# Altium schematic sheet MODULE.SchDoc: Air724UG 参考设计
size 594 x 419 mm; DESIGNER: Loukanghua; REV: V1.0
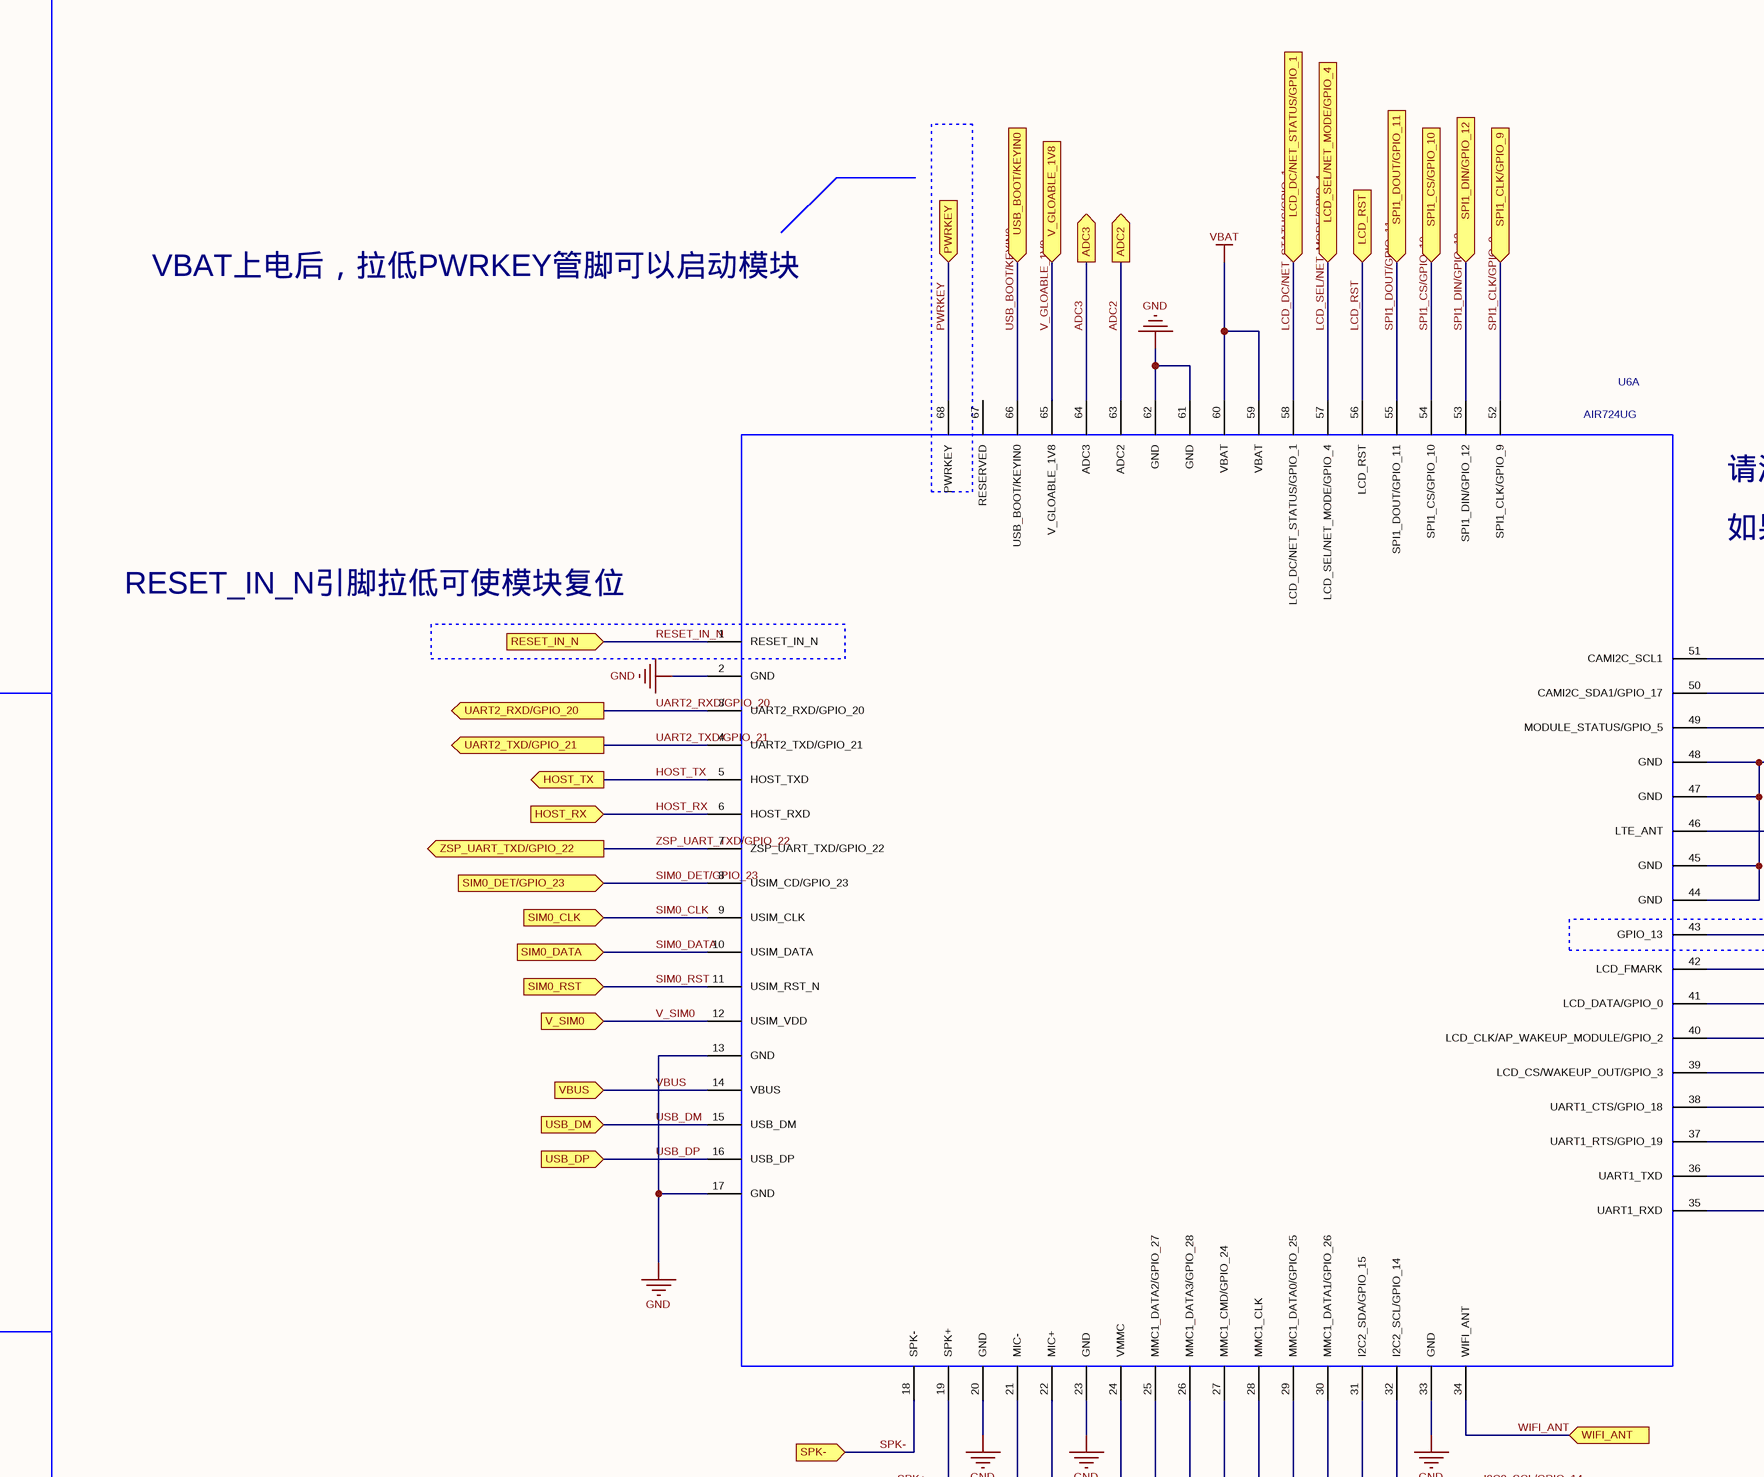
[diagram p0: MODULE.SchDoc, top left]
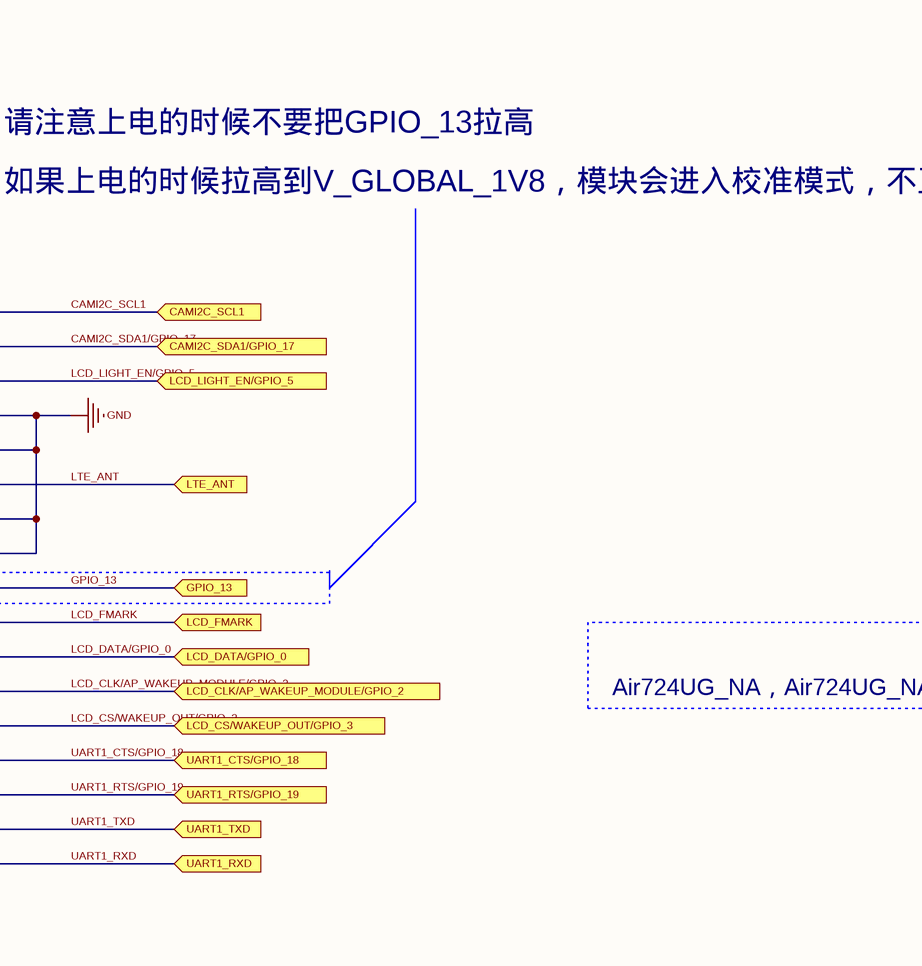
[diagram p1: MODULE.SchDoc, top middle]
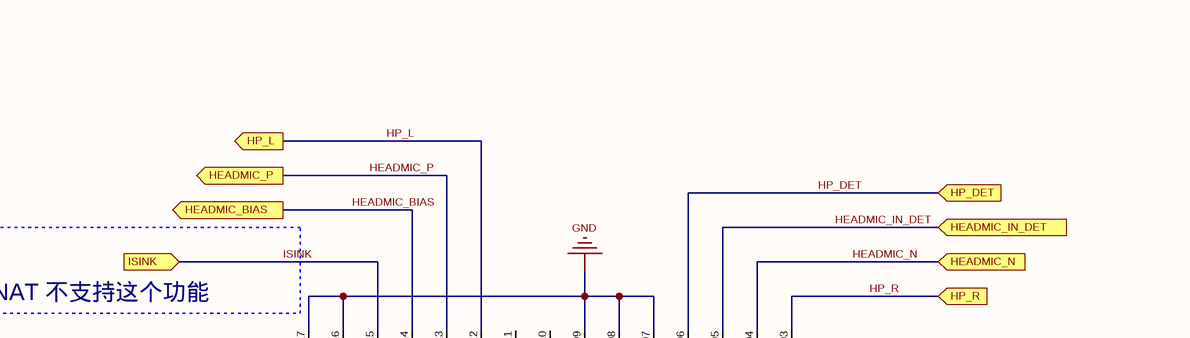
[diagram p2: MODULE.SchDoc, top right]
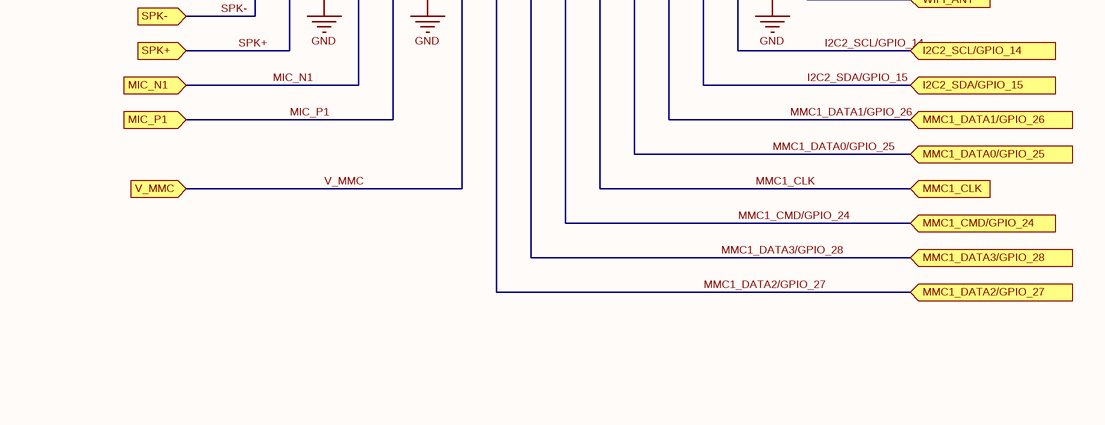
[diagram p3: MODULE.SchDoc, bottom left]
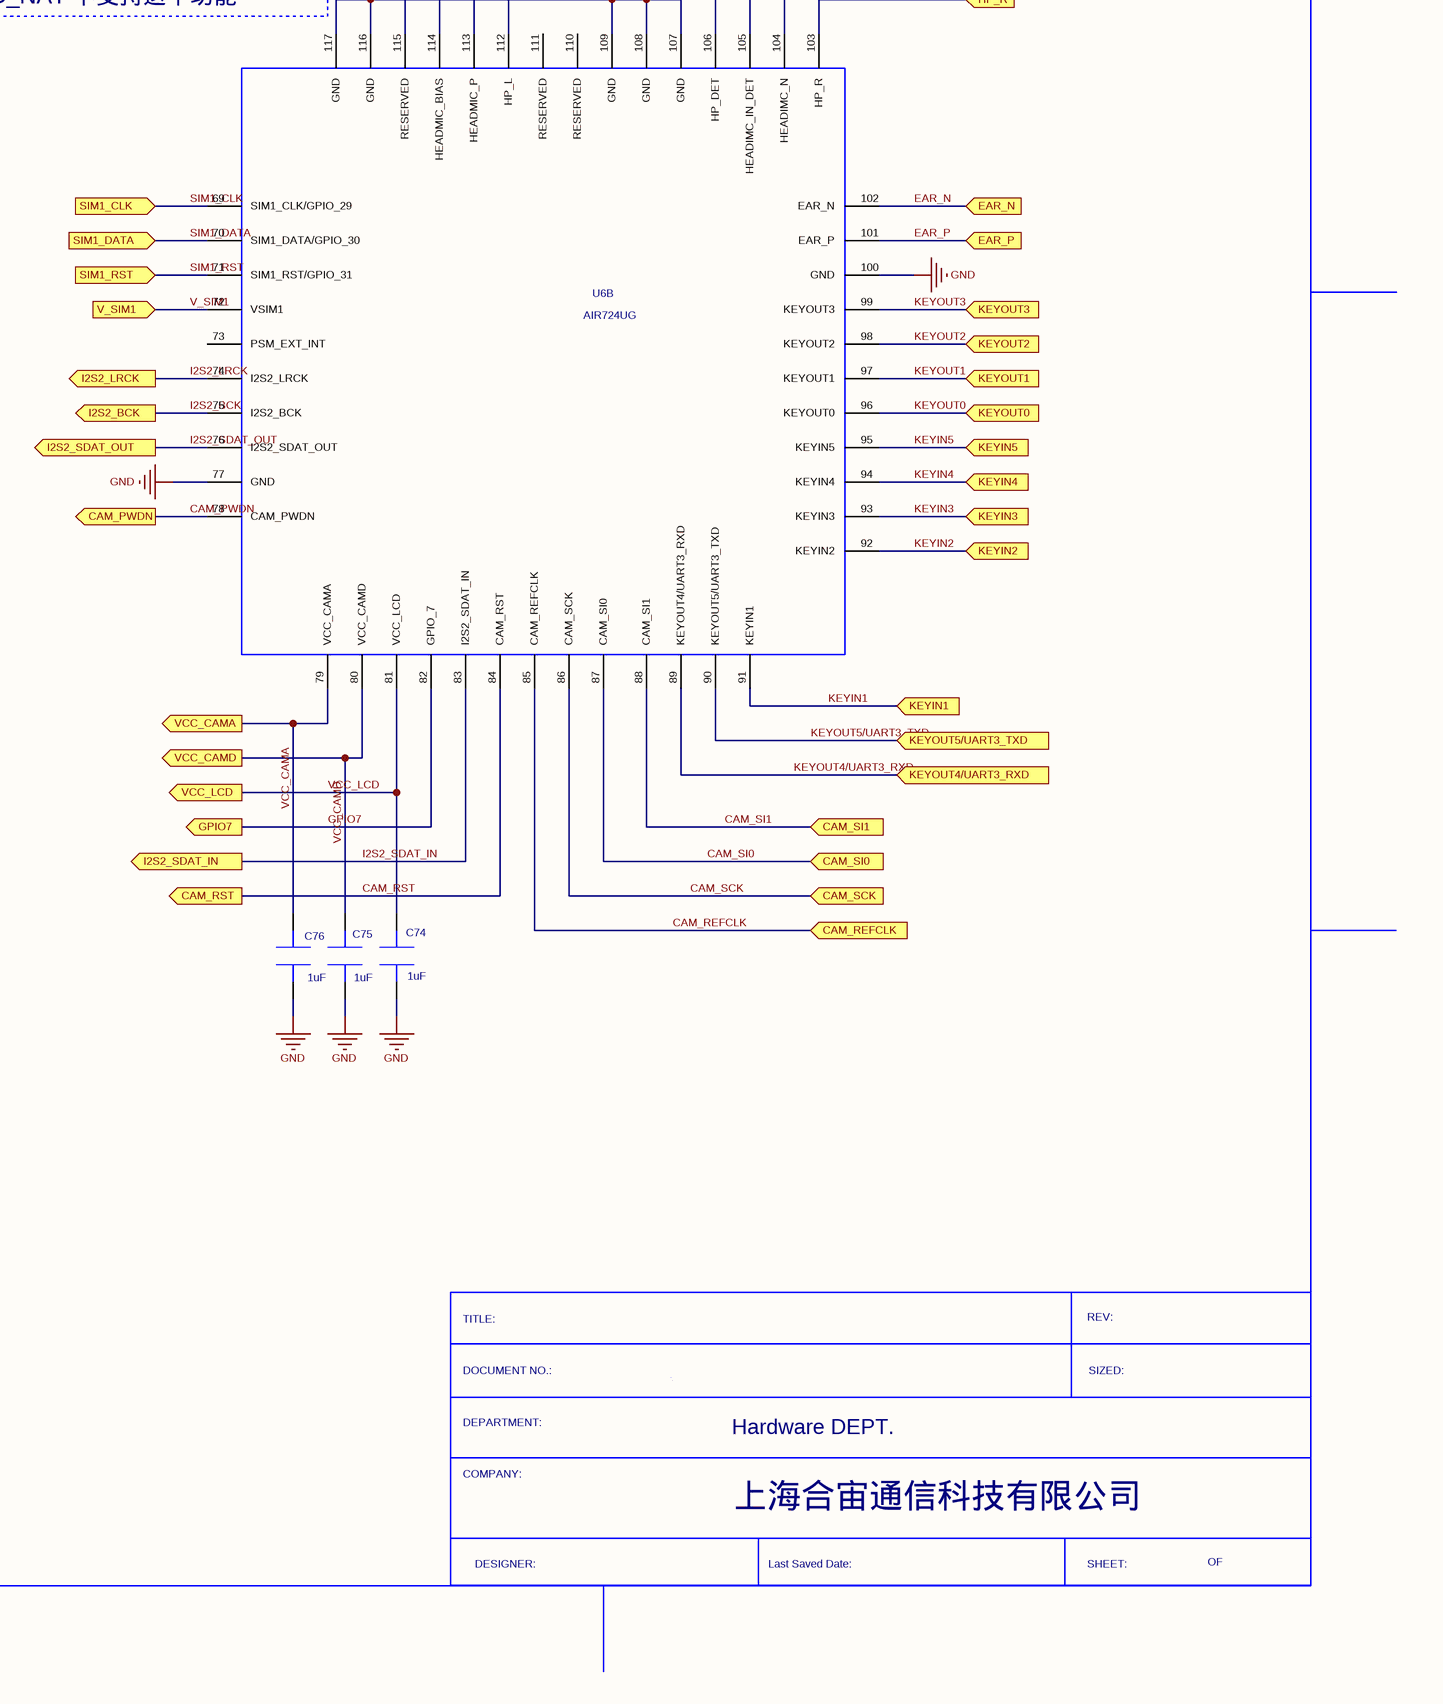
[diagram p4: MODULE.SchDoc, bottom right]

## Parts
C74  value 1uF  [SC0402]  (hidden comment: CAP-1UF-0402-X5R)
C75  value 1uF  [SC0402]  (hidden comment: CAP-1UF-0402-X5R)
C76  value 1uF  [SC0402]  (hidden comment: CAP-1UF-0402-X5R)
U6  AIR724UG  [AIR724UG]  (parts A,B of 2)

## Ports
ADC2 (out), ADC3 (out), CAM_PWDN (out), CAM_REFCLK (in), CAM_RST (out), CAM_SCK (in), CAM_SI0 (in), CAM_SI1 (in), CAMI2C_SCL1, CAMI2C_SDA1/GPIO_17, EAR_N (in), EAR_P (in), GPIO7 (out), GPIO_13 (in), HEADMIC_BIAS (out), HEADMIC_IN_DET, HEADMIC_N, HEADMIC_P (out), HOST_RX, HOST_TX (out), HP_DET (in), HP_L (out), HP_R (in), I2C2_SCL/GPIO_14, I2C2_SDA/GPIO_15, I2S2_BCK (out), I2S2_LRCK (out), I2S2_SDAT_IN (out), I2S2_SDAT_OUT (out), ISINK, KEYIN1 (in), KEYIN2 (in), KEYIN3 (in), KEYIN4 (in), KEYIN5 (in), KEYOUT0 (in), KEYOUT1 (in), KEYOUT2 (in), KEYOUT3 (in), KEYOUT4/UART3_RXD (in), KEYOUT5/UART3_TXD (in), LCD_CLK/AP_WAKEUP_MODULE/GPIO_2 (in), LCD_CS/WAKEUP_OUT/GPIO_3 (in), LCD_DATA/GPIO_0 (in), LCD_DC/NET_STATUS/GPIO_1 (in), LCD_FMARK (in), LCD_LIGHT_EN/GPIO_5, LCD_RST (in), LCD_SEL/NET_MODE/GPIO_4 (in), LTE_ANT, MIC_N1, MIC_P1, MMC1_CLK, MMC1_CMD/GPIO_24, MMC1_DATA0/GPIO_25, MMC1_DATA1/GPIO_26, MMC1_DATA2/GPIO_27, MMC1_DATA3/GPIO_28, PWRKEY, RESET_IN_N, SIM0_CLK, SIM0_DATA, SIM0_DET/GPIO_23, SIM0_RST, SIM1_CLK, SIM1_DATA, SIM1_RST, SPI1_CLK/GPIO_9 (in), SPI1_CS/GPIO_10 (in), SPI1_DIN/GPIO_12 (in), SPI1_DOUT/GPIO_11 (in), SPK+, SPK-, UART1_CTS/GPIO_18, UART1_RTS/GPIO_19 (in), UART1_RXD, UART1_TXD (in), UART2_RXD/GPIO_20 (out), UART2_TXD/GPIO_21 (out), USB_BOOT/KEYIN0, USB_DM, USB_DP, V_GLOABLE_1V8, V_MMC, V_SIM0, V_SIM1, VBUS, VCC_CAMA (out), VCC_CAMD (out), VCC_LCD (out), WIFI_ANT, ZSP_UART_TXD/GPIO_22 (out)

## Nets
GND: C74.1 C75.1 C76.1 U6.2(GND) U6.13(GND) U6.17(GND) U6.20(GND) U6.23(GND) U6.33(GND) U6.44(GND) U6.45(GND) U6.47(GND) U6.48(GND) U6.61(GND) U6.62(GND) U6.77(GND) U6.100(GND) U6.107(GND) U6.108(GND) U6.109(GND) U6.116(GND) U6.117(GND)
VBAT: U6.59(VBAT) U6.60(VBAT)
ADC2: U6.63(ADC2) ; port ADC2
ADC3: U6.64(ADC3) ; port ADC3
CAM_PWDN: U6.78(CAM_PWDN) ; port CAM_PWDN
CAM_REFCLK: U6.85(CAM_REFCLK) ; port CAM_REFCLK
CAM_RST: U6.84(CAM_RST) ; port CAM_RST
CAM_SCK: U6.86(CAM_SCK) ; port CAM_SCK
CAM_SI0: U6.87(CAM_SI0) ; port CAM_SI0
CAM_SI1: U6.88(CAM_SI1) ; port CAM_SI1
CAMI2C_SCL1: U6.51(CAMI2C_SCL1) ; port CAMI2C_SCL1
CAMI2C_SDA1/GPIO_17: U6.50(CAMI2C_SDA1/GPIO_17) ; port CAMI2C_SDA1/GPIO_17
EAR_N: U6.102(EAR_N) ; port EAR_N
EAR_P: U6.101(EAR_P) ; port EAR_P
GPIO7: U6.82(GPIO_7) ; port GPIO7
GPIO_13: U6.43(GPIO_13) ; port GPIO_13
HEADMIC_BIAS: U6.114(HEADMIC_BIAS) ; port HEADMIC_BIAS
HEADMIC_IN_DET: U6.105(HEADIMC_IN_DET) ; port HEADMIC_IN_DET
HEADMIC_N: U6.104(HEADIMC_N) ; port HEADMIC_N
HEADMIC_P: U6.113(HEADMIC_P) ; port HEADMIC_P
HOST_RX: U6.6(HOST_RXD) ; port HOST_RX
HOST_TX: U6.5(HOST_TXD) ; port HOST_TX
HP_DET: U6.106(HP_DET) ; port HP_DET
HP_L: U6.112(HP_L) ; port HP_L
HP_R: U6.103(HP_R) ; port HP_R
I2C2_SCL/GPIO_14: U6.32(I2C2_SCL/GPIO_14) ; port I2C2_SCL/GPIO_14
I2C2_SDA/GPIO_15: U6.31(I2C2_SDA/GPIO_15) ; port I2C2_SDA/GPIO_15
I2S2_BCK: U6.75(I2S2_BCK) ; port I2S2_BCK
I2S2_LRCK: U6.74(I2S2_LRCK) ; port I2S2_LRCK
I2S2_SDAT_IN: U6.83(I2S2_SDAT_IN) ; port I2S2_SDAT_IN
I2S2_SDAT_OUT: U6.76(I2S2_SDAT_OUT) ; port I2S2_SDAT_OUT
ISINK: U6.115(RESERVED) ; port ISINK
KEYIN1: U6.91(KEYIN1) ; port KEYIN1
KEYIN2: U6.92(KEYIN2) ; port KEYIN2
KEYIN3: U6.93(KEYIN3) ; port KEYIN3
KEYIN4: U6.94(KEYIN4) ; port KEYIN4
KEYIN5: U6.95(KEYIN5) ; port KEYIN5
KEYOUT0: U6.96(KEYOUT0) ; port KEYOUT0
KEYOUT1: U6.97(KEYOUT1) ; port KEYOUT1
KEYOUT2: U6.98(KEYOUT2) ; port KEYOUT2
KEYOUT3: U6.99(KEYOUT3) ; port KEYOUT3
KEYOUT4/UART3_RXD: U6.89(KEYOUT4/UART3_RXD) ; port KEYOUT4/UART3_RXD
KEYOUT5/UART3_TXD: U6.90(KEYOUT5/UART3_TXD) ; port KEYOUT5/UART3_TXD
LCD_CLK/AP_WAKEUP_MODULE/GPIO_2: U6.40(LCD_CLK/AP_WAKEUP_MODULE/GPIO_2) ; port LCD_CLK/AP_WAKEUP_MODULE/GPIO_2
LCD_CS/WAKEUP_OUT/GPIO_3: U6.39(LCD_CS/WAKEUP_OUT/GPIO_3) ; port LCD_CS/WAKEUP_OUT/GPIO_3
LCD_DATA/GPIO_0: U6.41(LCD_DATA/GPIO_0) ; port LCD_DATA/GPIO_0
LCD_DC/NET_STATUS/GPIO_1: U6.58(LCD_DC/NET_STATUS/GPIO_1) ; port LCD_DC/NET_STATUS/GPIO_1
LCD_FMARK: U6.42(LCD_FMARK) ; port LCD_FMARK
LCD_LIGHT_EN/GPIO_5: U6.49(MODULE_STATUS/GPIO_5) ; port LCD_LIGHT_EN/GPIO_5
LCD_RST: U6.56(LCD_RST) ; port LCD_RST
LCD_SEL/NET_MODE/GPIO_4: U6.57(LCD_SEL/NET_MODE/GPIO_4) ; port LCD_SEL/NET_MODE/GPIO_4
LTE_ANT: U6.46(LTE_ANT) ; port LTE_ANT
MIC_N1: U6.21(MIC-) ; port MIC_N1
MIC_P1: U6.22(MIC+) ; port MIC_P1
MMC1_CLK: U6.28(MMC1_CLK) ; port MMC1_CLK
MMC1_CMD/GPIO_24: U6.27(MMC1_CMD/GPIO_24) ; port MMC1_CMD/GPIO_24
MMC1_DATA0/GPIO_25: U6.29(MMC1_DATA0/GPIO_25) ; port MMC1_DATA0/GPIO_25
MMC1_DATA1/GPIO_26: U6.30(MMC1_DATA1/GPIO_26) ; port MMC1_DATA1/GPIO_26
MMC1_DATA2/GPIO_27: U6.25(MMC1_DATA2/GPIO_27) ; port MMC1_DATA2/GPIO_27
MMC1_DATA3/GPIO_28: U6.26(MMC1_DATA3/GPIO_28) ; port MMC1_DATA3/GPIO_28
PWRKEY: U6.68(PWRKEY) ; port PWRKEY
RESET_IN_N: U6.1(RESET_IN_N) ; port RESET_IN_N
SIM0_CLK: U6.9(USIM_CLK) ; port SIM0_CLK
SIM0_DATA: U6.10(USIM_DATA) ; port SIM0_DATA
SIM0_DET/GPIO_23: U6.8(USIM_CD/GPIO_23) ; port SIM0_DET/GPIO_23
SIM0_RST: U6.11(USIM_RST_N) ; port SIM0_RST
SIM1_CLK: U6.69(SIM1_CLK/GPIO_29) ; port SIM1_CLK
SIM1_DATA: U6.70(SIM1_DATA/GPIO_30) ; port SIM1_DATA
SIM1_RST: U6.71(SIM1_RST/GPIO_31) ; port SIM1_RST
SPI1_CLK/GPIO_9: U6.52(SPI1_CLK/GPIO_9) ; port SPI1_CLK/GPIO_9
SPI1_CS/GPIO_10: U6.54(SPI1_CS/GPIO_10) ; port SPI1_CS/GPIO_10
SPI1_DIN/GPIO_12: U6.53(SPI1_DIN/GPIO_12) ; port SPI1_DIN/GPIO_12
SPI1_DOUT/GPIO_11: U6.55(SPI1_DOUT/GPIO_11) ; port SPI1_DOUT/GPIO_11
SPK+: U6.19(SPK+) ; port SPK+
SPK-: U6.18(SPK-) ; port SPK-
UART1_CTS/GPIO_18: U6.38(UART1_CTS/GPIO_18) ; port UART1_CTS/GPIO_18
UART1_RTS/GPIO_19: U6.37(UART1_RTS/GPIO_19) ; port UART1_RTS/GPIO_19
UART1_RXD: U6.35(UART1_RXD) ; port UART1_RXD
UART1_TXD: U6.36(UART1_TXD) ; port UART1_TXD
UART2_RXD/GPIO_20: U6.3(UART2_RXD/GPIO_20) ; port UART2_RXD/GPIO_20
UART2_TXD/GPIO_21: U6.4(UART2_TXD/GPIO_21) ; port UART2_TXD/GPIO_21
USB_BOOT/KEYIN0: U6.66(USB_BOOT/KEYIN0) ; port USB_BOOT/KEYIN0
USB_DM: U6.15(USB_DM) ; port USB_DM
USB_DP: U6.16(USB_DP) ; port USB_DP
V_GLOABLE_1V8: U6.65(V_GLOABLE_1V8) ; port V_GLOABLE_1V8
V_MMC: U6.24(VMMC) ; port V_MMC
V_SIM0: U6.12(USIM_VDD) ; port V_SIM0
V_SIM1: U6.72(VSIM1) ; port V_SIM1
VBUS: U6.14(VBUS) ; port VBUS
VCC_CAMA: C76.2 U6.79(VCC_CAMA) ; port VCC_CAMA
VCC_CAMD: C75.2 U6.80(VCC_CAMD) ; port VCC_CAMD
VCC_LCD: C74.2 U6.81(VCC_LCD) ; port VCC_LCD
WIFI_ANT: U6.34(WIFI_ANT) ; port WIFI_ANT
ZSP_UART_TXD/GPIO_22: U6.7(ZSP_UART_TXD/GPIO_22) ; port ZSP_UART_TXD/GPIO_22

Not connected (* = marked no-connect by the designer): U6 67(RESERVED) 73(PSM_EXT_INT) 110(RESERVED) 111(RESERVED)

## Notes on the sheet
- VBAT上电后，拉低PWRKEY管脚可以启动模块
- (near U6) 请注意上电的时候不要把GPIO_13拉高
- (near U6) 如果上电的时候拉高到V_GLOBAL_1V8，模块会进入校准模式，不正常开机
- RESET_IN_N引脚拉低可使模块复位
- Air724UG_NA，Air724UG_NAT 不支持这个功能
- TITLE:
- REV:
- DEPARTMENT:
- DOCUMENT NO.:
- Hardware DEPT.
- SIZED:
- COMPANY:
- 上海合宙通信科技有限公司
- DESIGNER:
- Last Saved Date:
- SHEET:
- OF

## Library data of the parts
C74-C76 = CAP-1UF-0402-X5R: CAP CER X5R;1uF;+/-10%;6.3V;0402;0.5mm;ROHS; Manufacture 1 P/N: GRM155R60J105K****;CC0402KRX5R5BB105;C1005X5R0J105KT;JMK105BJ105KV-F;ECJ0EB0J105K;0402X105K6R3CT;CL05A105KQ5NNNC; Manufacture 1: Murata;Yageo;TDK;Taiyo Yuden;Panasonic;Walsin;Samsung; Serial Number: 80214710001; Geometry.Height: 0.55mm; Tolerance: +/-10%; PCB DECAL: SC0402
U6 = AIR724UG: Manufacture 1: AirM2M; Geometry.Height: 2.3mm; Manufacture 1 P/N: Air724UG; Description: Air724UG; PCB DECAL: AIR724UG